# Altium schematic sheet filtroBA.SchDoc
size A4
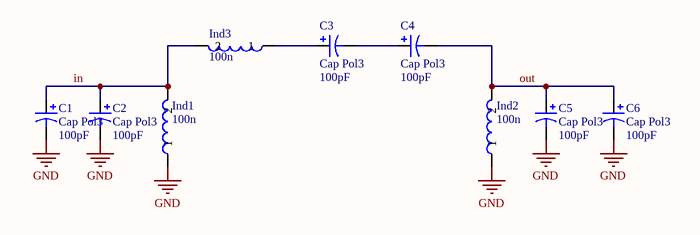
[diagram p0: filtroBA.SchDoc]

## Parts
C1  Cap Pol3  value 100pF  [C0805]
C2  Cap Pol3  value 100pF  [C0805]
C3  Cap Pol3  value 100pF  [C0805]
C4  Cap Pol3  value 100pF  [C0805]
C5  Cap Pol3  value 100pF  [C0805]
C6  Cap Pol3  value 100pF  [C0805]
Ind1  Valor: 100n  [Ind_3mm]  (hidden comment: Ind2)
Ind2  Valor: 100n  [Ind_3mm]  (hidden comment: Ind2)
Ind3  Valor: 100n  [IND_7MM]  (hidden comment: Ind2)

## Nets
GND: C1.2 C2.2 C5.2 C6.2 Ind1.1 Ind2.1
in: C1.1 C2.1 Ind1.2 Ind3.2
out: C4.2 C5.1 C6.1 Ind2.2
NetC3_1: C3.1 Ind3.1
NetC3_2: C3.2 C4.1

## Library data of the parts
C1-C6 = Cap Pol3: Polarized Capacitor (Surface Mount); Published: 8-Jun-2000; LatestRevisionDate: 17-Jul-2002; LatestRevisionNote: Re-released for DXP Platform.; PackageReference: C0805; Publisher: Altium Limited